# Altium schematic sheet Power Board.SchDoc
size A; Organization: Underwater Robotics; Address1: c/o Student Involvement; Address2: Campus Box 7306; Address3: 2016 Cates Ave. Raleigh, NC 27695; Revision: A1; SheetNumber: 1B; SheetTotal: 4B
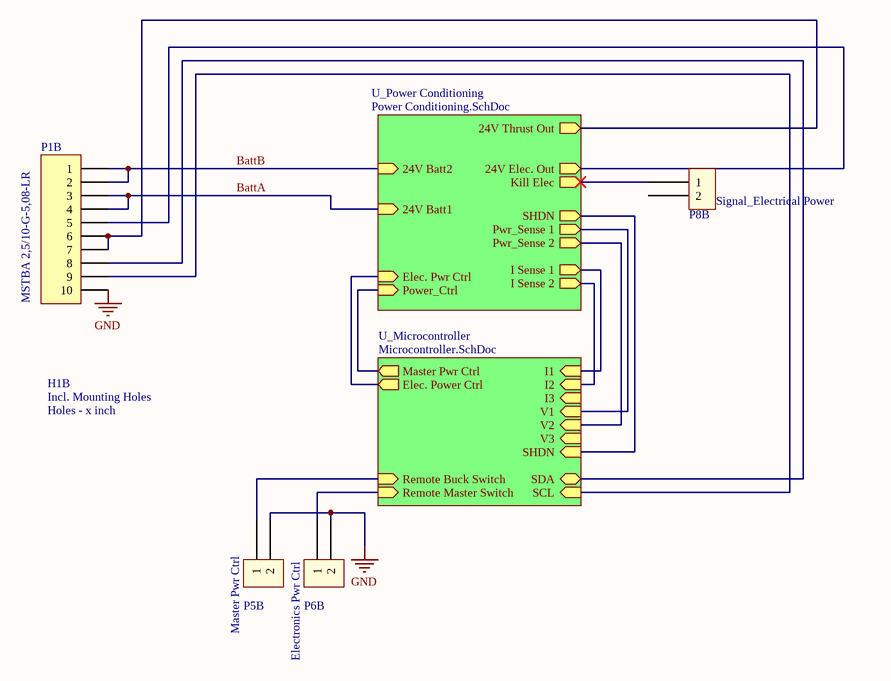
[diagram p0: Power Board.SchDoc]

## Parts
H1B  Holes - x inch  [110mil Holes - 2.5  Inch]
P1B  Manufacturer Part Number: MSTBA 2,5/10-G-5,08-LR  [MSTBA 2,5/10-G-5,08]  (hidden comment: MSTBA 2,5/10-G-5,08)
P5B  Header  [1x2 Header]  (value not drawn)
P6B  Header  [1x2 Header]  (value not drawn)
P8B  Header  [1x2 Header]  (value not drawn)

## Sub-sheets
U_Microcontroller = Microcontroller.SchDoc: SDA (bidir), SCL (in), I1 (in), I2 (in), I3 (in), V1 (in), V2 (in), V3 (in), Master Pwr Ctrl (out), Elec. Power Ctrl (out), SHDN (in), Remote Buck Switch (in), Remote Master Switch (in)
U_Power Conditioning = Power Conditioning.SchDoc: 24V Elec. Out (out), Power_Ctrl (in), Pwr_Sense 1 (out), 24V Thrust Out (out), Pwr_Sense 2 (out), I Sense 1 (out), I Sense 2 (out), 24V Batt1 (in), 24V Batt2 (in), SHDN (out), Elec. Pwr Ctrl (in), Kill Elec (out)

## Nets
GND: P1B.10 P5B.2 P6B.2
BattA: P1B.3 P1B.4 ; sheet U_Power Conditioning/24V Batt1
BattB: P1B.1 P1B.2 ; sheet U_Power Conditioning/24V Batt2
NetP1B_5: P1B.5 ; sheet U_Power Conditioning/24V Elec. Out
NetP1B_6: P1B.6 P1B.7 ; sheet U_Power Conditioning/24V Thrust Out
NetP1B_8: P1B.8 ; sheet U_Microcontroller/SDA
NetP1B_9: P1B.9 ; sheet U_Microcontroller/SCL
NetP5B_1: P5B.1 ; sheet U_Microcontroller/Remote Buck Switch
NetP6B_1: P6B.1 ; sheet U_Microcontroller/Remote Master Switch
NetP8B_1: P8B.1 ; sheet U_Power Conditioning/Kill Elec
(unnamed): sheet U_Microcontroller/I1, sheet U_Power Conditioning/I Sense 1
(unnamed): sheet U_Microcontroller/I2, sheet U_Power Conditioning/I Sense 2
(unnamed): sheet U_Microcontroller/V1, sheet U_Power Conditioning/Pwr_Sense 1
(unnamed): sheet U_Microcontroller/V2, sheet U_Power Conditioning/Pwr_Sense 2
(unnamed): sheet U_Microcontroller/Master Pwr Ctrl, sheet U_Power Conditioning/Power_Ctrl
(unnamed): sheet U_Microcontroller/Elec. Power Ctrl, sheet U_Power Conditioning/Elec. Pwr Ctrl
(unnamed): sheet U_Microcontroller/SHDN, sheet U_Power Conditioning/SHDN

Not connected (* = marked no-connect by the designer): P8B 2

## Notes on the sheet
- (near P8B) Signal_Electrical Power
- (near P5B) Master Pwr Ctrl
- Electronics Pwr Ctrl
- Title
- Size:
- Date:
- A
- Number:
- Time:
- Revision:
- Sheet
- of
- File:
- (in symbol Holes - x inch) Incl. Mounting Holes

## Library data of the parts
P1B = MSTBA 2,5/10-G-5,08: Header, 10-Pin; Manufacturer 1: PHOENIX CONTACT; Description 1: PHOENIX CONTACT - MSTBA 2,5/10-G-5,08-LR - TERMINAL BLOCK, HEADER, 10POS, TH; URL: http://www.mouser.com/ProductDetail/Phoenix-Contact/1792708/?qs=sGAEpiMZZMsDddcp1dBDJI66tvLKBAoKnRJwuCPjeJk%3d; Supplier 1: Newark; Supplier Part Number 1: 88W5041; RoHS: YES; Stock 1: 37; Pricing 1: 1=3.07, 100=2.89, 250=2.67, 500=2.55, 1000=2.27 (USD); ComponentLink1URL: http://www.farnell.com/datasheets/1702208.pdf; ComponentLink1Description: http://www.farnell.com/datasheets/1702208.pdf
P5B P6B P8B = 1x2 Header